# EasyEDA Pro project ProPrj_电力电子综合设计_2025-07-04.epro, board PCB4
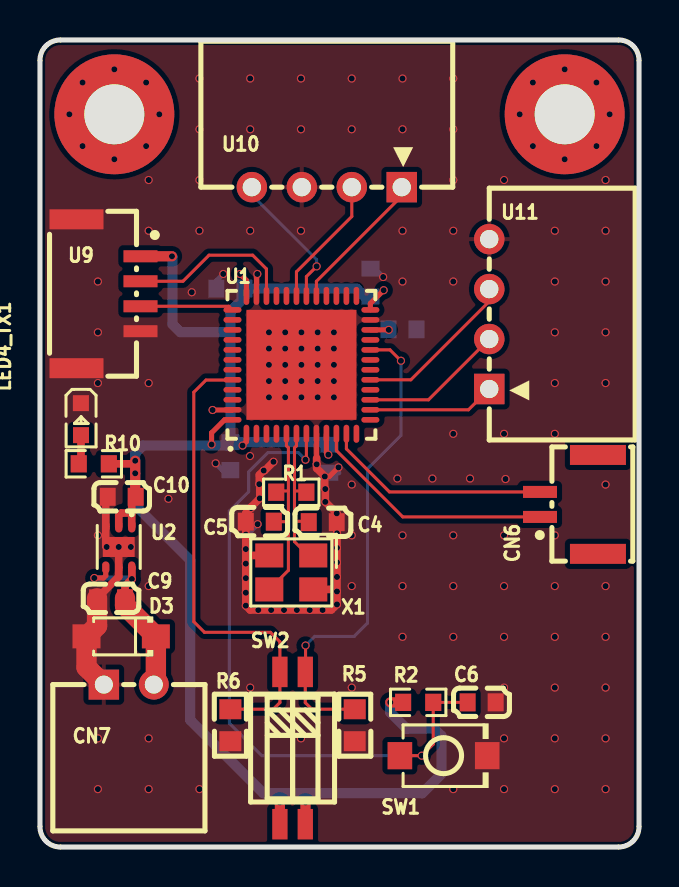
[diagram p3: board, top side]
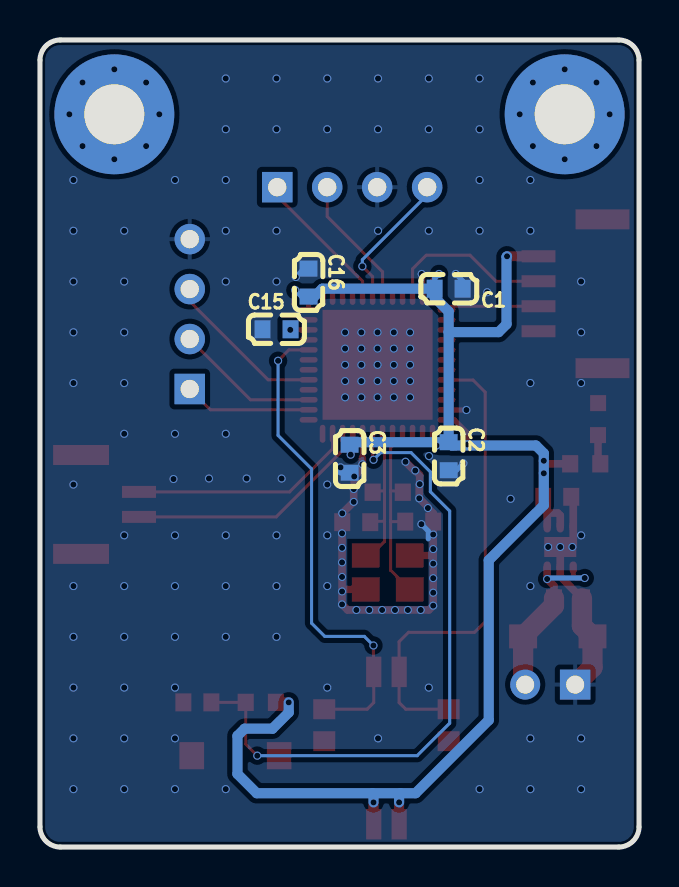
[diagram p4: board, bottom side, seen from below]

Outline 29.97 x 40.39 mm; copper layers: Top Layer, Bottom Layer. Coordinates in mm from the lower left corner of the outline.
Outline path: 0,39.37 0,1.02 arc(0.3,0.3) 1.02,0 28.96,0 arc(29.67,0.3) 29.97,1.02 29.97,39.37 arc(29.67,40.09) 28.96,40.39 1.02,40.39 arc(0.3,40.09) 0,39.37
Stack: Top Layer 0.035mm / Dielectric1 1.51mm FR4 er 4.5 / Bottom Layer 0.035mm

## Design rules (mm)
net OSC32_OUT: DP1
net OSC32_IN: DP1
template: 四层板
spacing copperThickness1oz (default): track to track 0.102, other pairs 0.152 to 0.3
spacing copperThickness2oz: track to track 0.203, other pairs 0.152 to 0.3
spacing copperThicknessInner0.5oz: track to track 0.089, other pairs 0.152 to 0.3
track width copperThickness1oz (default): min 0.102, default 0.254, max 2.54
track width copperThickness0.5oz: min 0.089, default 0.254, max 2.54
track width copperThickness2oz: min 0.203, default 0.254, max 2.54
differential pair differentialPair (default): width min 0.127, default 0.254, max 2.54; gap min 0.152, default 0.152
via viaSize (default): diameter min 0.3, default 0.61, max 10; hole min 0.2, default 0.305, max 6.3

## Placement (name value [footprint] x y rotation side)
C1  100nF  [C0603]  9.52 27.94 0 bottom
C2  100nF  [C0603]  9.52 19.56 270 bottom
C3  100nF  [C0603]  14.48 19.43 270 bottom
C4  12PF  [C0603]  14.15 16.26 180 top
C5  12PF  [C0603]  11 16.28 0 top
C6  0.1uF  [C0603]  22.1 7.24 0 top
C9  2.2uF  [C0603]  3.56 12.45 0 top
C10  2.2uF  [C0603]  4.09 17.53 0 top
C15  4.7uF  [C0603]  18.14 25.91 180 bottom
C16  100nF  [C0603]  16.54 28.24 270 bottom
CN6  WAFER-GH1.25-2PWB  [CONN-TH_2P-P1.25_XUNPU_WAFER-GH1.25-2PWB]  26.47 17.14 90 top
CN7  ZX-XH2.54-2PWZ  [CONN-TH_2P-P2.50_ZX-XH2.54-2PWZ]  4.44 8.13 0 top
D3  SMF6.0A  [SOD-123FL_L2.7-W1.8-LS3.8-RD]  4.06 10.54 180 top
LED4_TX1  -  [LED_0603]  2.06 21.36 270 top
NOREF  -  [Pad_e32]  26.25 36.67 270 top
NOREF#2  -  [Pad_e33]  3.72 36.67 0 top
R1  1M  [R0603]  12.57 17.75 180 top
R2  10k  [R0603]  18.92 7.24 180 top
R5  10K  [0603]  15.75 6.1 270 top
R6  10K  [0603]  9.52 6.1 270 top
R10  10K  [R0603]  2.69 19.18 0 top
SW1  SKRKAEE020  [SW-SMD_L3.9-W3.0-P4.45]  20.19 4.57 0 top
SW2  DSHP02TSGET  [SW-SMD_4P_DSHP02TSGET]  12.64 4.95 180 top
U1  STM32F411CEU6  [UFQFPN-48_L7.0-W7.0-P0.50-BL-EP]  13.08 24.13 0 top
U2  TLV76733DRVR  [WSON-6_L2.0-W2.0-P0.65-TL-EP]  3.94 15.02 270 top
U9  XY-GH1.25-4A61  [CONN-SMD_4P-P1.25_XYECONN_XY-GH1.25-4A61]  3.43 27.69 270 top
U10  8821WR-04P  [CONN-TH_X8821WR-04SL-N0SN]  14.35 33.02 180 top
U11  8821WR-04P  [CONN-TH_X8821WR-04SL-N0SN]  22.48 26.67 90 top
X1  25MHz  [CRYSTAL-SMD_4P-L3.2-W2.5-BL]  12.57 13.74 180 top

## Footprints (pads in the part's own frame, mm; a bottom-side part is the same pattern mirrored in y, then rotated)
0603
  rect 1x1.1 smd: 1(-0.8,0) 2(0.8,0)
C0603
  rect 0.8x0.9 smd: 1(-0.7,0) 2(0.7,0)
CONN-SMD_4P-P1.25_XYECONN_XY-GH1.25-4A61
  rect 0.6x1.7 smd: 1(-1.875,1.6) 2(-0.625,1.6) 3(0.625,1.6) 4(1.875,1.6)
  rect 1x2.7 smd: 5(3.725,-1.6) 6(-3.725,-1.6)
CONN-TH_2P-P1.25_XUNPU_WAFER-GH1.25-2PWB
  rect 0.6x1.7 smd: 1(-0.625,1.45) 2(0.625,1.45)
  rect 1x2.8 smd: 3(-2.475,-1.45) 4(2.475,-1.45)
CONN-TH_2P-P2.50_ZX-XH2.54-2PWZ
  rect 1.524x1.5 hole 0.9: 1(-1.25,0)
  round 1.5 hole 0.9: 2(1.25,0)
CONN-TH_X8821WR-04SL-N0SN
  rect 1.524x1.524 hole 0.914: 1(-3.75,0)
  round 1.524 hole 0.914: 2(-1.25,0) 3(1.25,0) 4(3.75,0)
CRYSTAL-SMD_4P-L3.2-W2.5-BL
  rect 1.4x1.2 smd: 1(-1.1,-0.85) 2(1.1,-0.85) 3(1.1,0.85) 4(-1.1,0.85)
LED_0603
  rect 0.8x0.8 smd: 1(-0.851,-0.01) 2(0.75,-0.005)
Pad_e32
  round 6 hole 3: 1(0,0)
Pad_e33
  round 6 hole 3: 1(0,0)
R0603
  rect 0.806x0.864 smd: 1(-0.753,0) 2(0.753,0)
SOD-123FL_L2.7-W1.8-LS3.8-RD
  rect 1.4x1.2 smd: 1(-1.735,0) 2(1.735,0)
SW-SMD_4P_DSHP02TSGET
  rect 0.762x1.524 smd: 1(-0.635,-3.81) 2(0.635,-3.81) 3(0.635,3.81) 4(-0.635,3.81)
SW-SMD_L3.9-W3.0-P4.45
  rect 1.23x1.36 smd: 1(-2.185,0) 2(2.185,0)
UFQFPN-48_L7.0-W7.0-P0.50-BL-EP
  oval 0.28x0.9 smd: 1(-2.751,-3.45) 2(-2.251,-3.45) 3(-1.75,-3.45) 4(-1.25,-3.45) 5(-0.749,-3.45) 6(-0.249,-3.45) 7(0.249,-3.45) 8(0.75,-3.45) 9(1.25,-3.45) 10(1.75,-3.45) 11(2.251,-3.45) 12(2.751,-3.45) 25(2.751,3.449) 26(2.251,3.449) 27(1.75,3.449) 28(1.25,3.449) 29(0.75,3.449) 30(0.249,3.449) 31(-0.249,3.449) 32(-0.749,3.449) 33(-1.25,3.449) 34(-1.75,3.449) 35(-2.251,3.449) 36(-2.751,3.449)
  oval 0.9x0.28 smd: 13(3.45,-2.751) 14(3.45,-2.251) 15(3.45,-1.75) 16(3.45,-1.25) 17(3.45,-0.75) 18(3.45,-0.249) 19(3.45,0.249) 20(3.45,0.749) 21(3.45,1.25) 22(3.45,1.75) 23(3.45,2.251) 24(3.45,2.751) 37(-3.449,2.751) 38(-3.449,2.251) 39(-3.449,1.75) 40(-3.449,1.25) 41(-3.449,0.749) 42(-3.449,0.249) 43(-3.449,-0.249) 44(-3.449,-0.75) 45(-3.449,-1.25) 46(-3.449,-1.75) 47(-3.449,-2.251) 48(-3.449,-2.751)
  rect 5.5x5.5 smd: 49(0,0)
WSON-6_L2.0-W2.0-P0.65-TL-EP
  oval 0.607x0.364 smd: 1(-1.028,0.65) 2(-1.028,0) 3(-1.028,-0.65) 4(1.028,-0.65) 5(1.028,0) 6(1.028,0.65)
  rect 1x1.6 smd: 7(0,0)

## Nets
As in the schematic.

Pads without a net: CN6 3 4; NOREF 1; NOREF#2 1; U1 2 3 4 12 13 18 19 21 25 26 27 28 32 33 38 39 40 41 42 43 45 46

## Via types
v1: diameter 0.406, hole 0.305, Top Layer to Bottom Layer, 183 vias

## Routing (per net, layer and track width the routed paths; a pad name or vN(x,y) marks a point on that pad's centre or on a via; arc(x,y) is an arc through that point)
3V3: length 84.3
  Top Layer w0.254: v1(10.13,20.09) 10.33,20.29 U1.1 ; v1(8.58,20.14) 8.58,20.73 9.24,21.38 U1.48 ; U1.36 10.33,28.35 v1(10.01,28.68) ; U1.24 16.53,27.2 v1(17.2,27.86) ; v1(14.43,19.63) 14.33,19.73 U1.9
  Top Layer w0.381: 4.59,16.7 4.59,17.33 C10.2 ; 4.59,16.7 4.58,16.71 4.06,16.71 3.94,16.59 3.94,16.04 ; 4.59,16.7 4.59,16.04 ; v1(4.76,19.33) 4.61,19.18 R10.2
  Top Layer w0.508: v1(4.76,19.33) v1(4.76,18.7) 4.76,17.55 C10.2 ; 13.28,2.18 13.28,1.15 SW2.4 ; SW2.3 v1(12,2.23) ; U9.1 v1(6.6,29.56) ; R2.2 v1(17.53,7.24)
  Bottom Layer w0.254: v1(10.01,28.68) 10.22,28.46 C1.2 ; v1(17.2,27.86) 16.88,27.55 C16.2
  Bottom Layer w0.508: 11.94,2.69 13.32,2.69 ; 11.94,2.69 11.18,2.69 7.52,6.35 7.52,14.35 4.76,17.11 v1(4.76,18.7) v1(4.76,19.33) 4.76,19.7 5.16,20.09 9.36,20.09 C2.1 ; 11.94,2.69 12,2.63 v1(12,2.23) ; 13.32,2.69 19.13,2.69 20.09,3.66 20.09,5.56 19.73,5.92 18.34,5.92 17.53,6.73 v1(17.53,7.24) ; 13.32,2.69 13.28,2.66 v1(13.28,2.23) ; v1(6.6,29.56) 6.63,29.54 6.63,26.16 7.02,25.77 9.52,25.77 ; C3.1 14.35,20.26 C2.1 ; 9.52,25.77 9.52,26.8 10.22,27.5 C1.2 15.85,27.94 16.38,27.41 ; 9.52,25.77 C2.1
+5V: length 9.6
  Top Layer w0.254: U2.4 3.29,13.58 3.17,13.46 v1(2.72,13.46)
  Top Layer w0.381: U2.6 4.6,13.98 v1(4.6,13.41) 4.26,13.07 4.26,12.45
  Top Layer w1.016: CN7.2 5.8,8.23 D3.1 4.26,12.08 4.26,12.45
  Bottom Layer w0.254: v1(4.6,13.41) 4.55,13.46 v1(2.72,13.46)
GND: length 41.6
  Top Layer w0.254: U1.35 10.83,28.63 v1(10.88,28.68) ; v1(14.25,18.54) 14.48,18.54 v1(14.94,19) ; U1.47 9.62,21.87 v1(8.64,21.87) ; 13.84,19.46 13.84,20.67 U1.8
  Top Layer w0.381: v1(3.94,15.02) U2.5 3.94,13.53 C9.1 ; v1(14.86,12.79) 14.76,12.89 X1.4 ; v1(14.86,12.79) v1(14.86,12.14) 14.58,11.86 v1(14.14,11.86) v1(13.5,11.86) v1(12.85,11.86) v1(12.21,11.86) v1(10.92,11.86) 10.52,11.86 v1(10.3,12.08) v1(10.3,12.73) v1(10.3,13.45) v1(10.3,14.18) 10.3,14.6 ; v1(14.86,12.79) v1(14.86,13.52) v1(14.86,14.24) v1(14.86,14.97) v1(14.86,15.7) 14.86,16.24 C4.1 v1(14.85,16.7) v1(14.27,17.27) v1(14.27,17.91) 14.25,17.94 v1(14.25,18.54) 13.84,18.95 v1(13.84,19.15) 13.84,19.46 ; 10.3,14.6 v1(10.3,14.91) v1(10.3,15.64) C5.1 10.3,16.7 v1(10.56,16.96) 10.56,17.01 v1(11,17.45) 11,18.13 v1(10.97,18.16) 10.97,18.62 v1(11.19,18.84) 11.25,18.84 v1(11.68,19.28) ; 10.3,14.6 10.31,14.59 X1.2 ; C10.1 3.29,17.43 3.29,15.06 v1(3.34,15.02)
  Top Layer w1.016: C9.1 2.86,11.07 D3.2 2.33,8.99 CN7.1
  Bottom Layer w0.254: C3.2 14.95,18.73 14.94,18.74 v1(14.94,19) ; v1(17.17,28.52) 16.75,28.94 C16.1 ; v1(10.89,16.16) 10.54,15.81 10.54,15.42 ; v1(8.79,19.2) 9.13,18.86 C2.2 ; C1.1 8.82,28.33 v1(9.17,28.68)
  vias: v1(2.9,28.3) v1(2.9,25.76) v1(2.9,23.22) v1(2.9,15.6) v1(2.9,5.44) v1(2.9,2.9) v1(4.55,15.02) v1(5.44,33.38) v1(5.44,30.84) v1(5.44,23.22) v1(5.44,13.06) v1(5.44,5.44) v1(5.44,2.9) v1(6.43,17.42) v1(7.59,27.76) v1(7.98,38.46) v1(7.98,35.92) v1(7.98,33.38) v1(7.98,30.84) v1(7.98,2.9) v1(10.52,38.46) v1(10.52,35.92) v1(10.52,30.84) v1(10.51,19.57) v1(10.52,7.98) v1(11.46,25.76) v1(11.46,24.94) v1(11.46,24.13) v1(11.46,23.32) v1(11.46,22.5) v1(11.57,11.86) v1(12.27,25.76) v1(12.27,24.94) v1(12.27,24.13) v1(12.27,23.32) v1(12.27,22.5) v1(13.06,38.46) v1(13.06,35.92) v1(13.06,30.84) v1(13.08,25.76) v1(13.08,24.94) v1(13.08,24.13) v1(13.08,23.32) v1(13.08,22.5) v1(13.06,5.44) v1(13.89,25.76) v1(13.89,24.94) v1(13.89,24.13) v1(13.89,23.32) v1(13.89,22.5) v1(14.71,25.76) v1(14.71,24.94) v1(14.71,24.13) v1(14.71,23.32) v1(14.71,22.5) v1(15.6,38.46) v1(15.6,35.92) v1(15.6,18.14) v1(15.6,15.6) v1(15.6,13.06) v1(15.6,7.98) v1(17.88,18.44) v1(18.14,38.46) v1(18.14,35.92) v1(18.14,30.84) v1(18.14,28.3) v1(18.14,15.6) v1(18.14,13.06) v1(18.14,10.52) v1(19.63,18.44) v1(20.68,38.46) v1(20.68,35.92) v1(20.68,33.38) v1(20.68,30.84) v1(20.68,28.3) v1(20.68,20.68) v1(20.68,15.6) v1(20.68,13.06) v1(20.68,10.52) v1(20.68,2.9) v1(21.52,18.44) v1(23.22,33.38) v1(23.22,20.68) v1(23.29,18.41) v1(23.22,15.6) v1(23.22,13.06) v1(23.22,10.52) v1(23.22,7.98) v1(23.22,5.44) v1(23.22,2.9) v1(25.76,30.84) v1(25.76,28.3) v1(25.76,25.76) v1(25.76,23.22) v1(25.76,20.68) v1(25.76,15.6) v1(25.76,13.06) v1(25.76,10.52) v1(25.76,7.98) v1(25.76,5.44) v1(25.76,2.9) v1(28.3,33.38) v1(28.3,30.84) v1(28.3,28.3) v1(28.3,25.76) v1(28.3,23.22) v1(28.3,18.14) v1(28.3,13.06) v1(28.3,10.52) v1(28.3,7.98) v1(28.3,5.44) v1(28.3,2.9)
(no net):
  vias: v1(1.47,36.67) v1(2.13,38.26) v1(2.13,35.08) v1(3.72,38.92) v1(3.72,34.42) v1(5.31,38.26) v1(5.31,35.08) v1(5.97,36.67) v1(24,36.67) v1(24.66,38.26) v1(24.66,35.08) v1(26.25,38.92) v1(26.25,34.42) v1(27.84,38.26) v1(27.84,35.08) v1(28.5,36.67)
ADC1_IN0: length 11.6
  Top Layer w0.152: 24.2,16.52 18.15,16.52 14.83,19.84 U1.10
ADC1_IN1: length 10.5
  Top Layer w0.152: U1.11 15.33,19.92 17.48,17.77 24.2,17.77
BOOT0: length 24.1
  Top Layer w0.152: U1.44 9.62,23.37 8.31,23.37 7.7,22.76 7.7,11.28 8.23,10.74 11.53,10.74 12,10.27 SW2.2 12,7.23 11.67,6.9 9.52,6.9
BOOT1: length 24.6
  Top Layer w0.152: 15.75,6.9 13.6,6.9 13.27,7.22 SW2.1 13.29,8.78 v1(13.29,10.08) ; U1.20 17.51,24.88 v1(18.06,24.33)
  Bottom Layer w0.152: v1(13.29,10.08) 13.74,10.54 15.72,10.54 16.38,11.2 16.38,18.92 18.06,20.6 v1(18.06,24.33)
CLK: length 7.2
  Top Layer w0.152: U1.15 19.44,22.38 U11.2
CS: length 6.4
  Top Layer w0.152: U11.1 21.44,21.88 U1.14
DO: length 8.2
  Top Layer w0.152: U11.3 22.48,27.3 18.55,23.38 U1.17
NRST: length 33.7
  Top Layer w0.152: C6.1 R2.1 19.68,5.15 v1(19.1,4.57) SW1.1 ; U1.7 13.33,19.43 v1(13.28,19.38)
  Bottom Layer w0.152: v1(13.28,19.38) 12.93,19.74 11.4,19.74 10.44,18.77 10.44,17.78 9.47,16.81 9.47,6.2 11.1,4.57 v1(19.1,4.57)
OSC32_IN: length 9.6
  Top Layer w0.152: 12.43,16.31 12.43,13.85 X1.3 ; 12.43,16.31 12.43,17.82 ; 12.43,16.31 12.4,16.28 C5.2 ; 12.43,17.82 11.88,17.82 R1.2 ; 12.43,17.82 12.43,19.98 12.33,20.08 U1.5
OSC32_OUT: length 8
  Top Layer w0.152: 12.73,17.82 12.73,16.3 ; 12.73,17.82 13.26,17.82 R1.1 ; 12.73,17.82 12.73,19.98 12.83,20.08 U1.6 ; 12.73,16.3 12.73,15.28 13.42,14.59 X1.1 ; 12.73,16.3 13.4,16.3 C4.2
PWM: length 7.2
  Top Layer w0.152: U10.1 18.1,32.58 13.83,28.31 U1.29
PWM1: length 7
  Top Layer w0.152: U1.30 13.33,28.54 v1(13.84,29.06)
  Bottom Layer w0.152: v1(13.84,29.06) 13.84,29.39 10.6,32.63 U10.4
PWMCON: length 6.6
  Top Layer w0.152: U1.31 12.83,28.78 15.6,31.55 U10.2
SWCLK: length 4.7
  Top Layer w0.152: U1.37 9.45,27.06 U9.3
SWDIO: length 8.5
  Top Layer w0.152: U1.34 11.33,28.93 10.64,29.62 8.46,29.62 7.15,28.31 U9.2
VACP: length 0.9
  Top Layer w0.254: U1.22 v1(17.45,25.88)
$1N1231: length 1.5
  Top Layer w0.381: LED4_TX1.2 2.05,19.29 R10.1

## Copper pours and planes (outline as drawn; the poured copper is in the pictures)
GND on Top Layer: -1.22,42.44 31.8,42.44 31.8,-1.14 -1.22,-1.14
GND on Bottom Layer: 10.34,26.87 15.82,26.87 15.82,21.39 10.34,21.39
GND on Bottom Layer: -1.91,41.38 31.52,41.38 31.52,-1.3 -1.91,-1.3
GND on Bottom Layer: 3.07,15.52 4.8,15.52 4.8,14.5 3.07,14.5
